# Altium project PWM_Controller_Half_Bridge_IR2110.PrjPCB
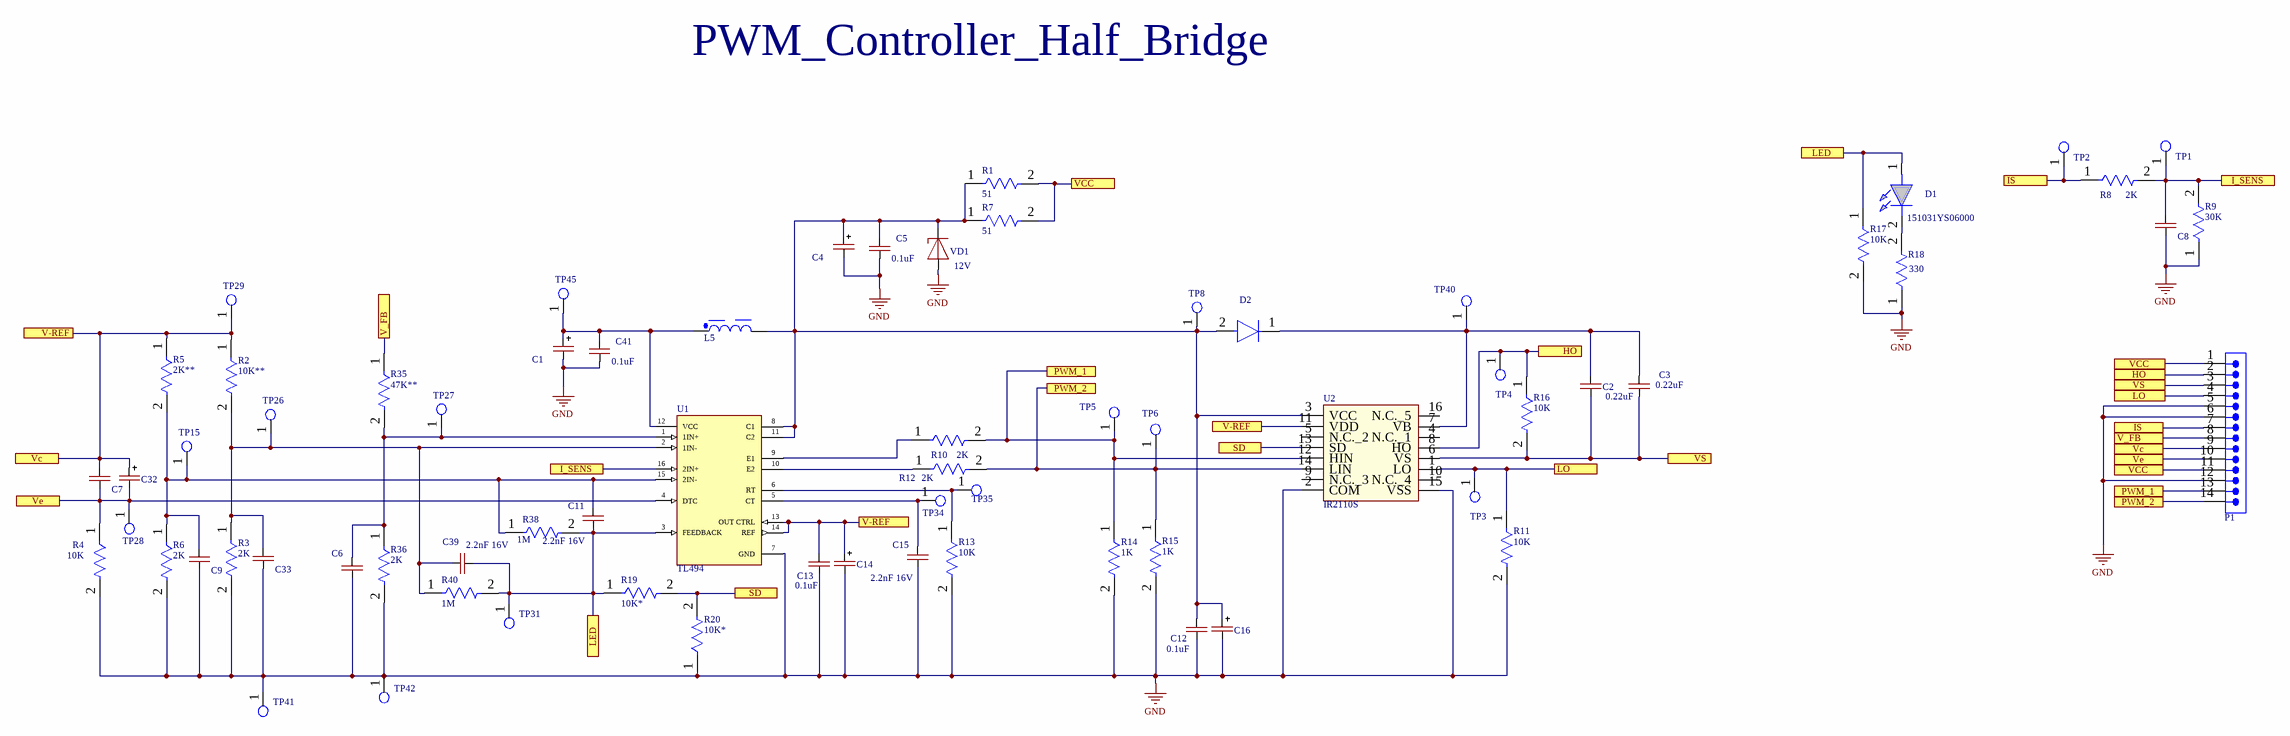
[diagram p0: PWM_Controller_Half_Bridge_IR2110.SchDoc]
1 sheet, 69 parts. Net scope: flat (ports and power ports of the same name join across sheets).
Board file: PWM_Controller_Half_Bridge_IR2110.PcbDoc

## Sheet PWM_Controller_Half_Bridge_IR2110.SchDoc
size A1; SPICEModelCacheYQEDCYZF: <root> / <DocumentId>YQEDCYZF</DocumentId> / <CacheFrame Number="0"> / <Model Name="7850_744775147_47u" Kind="CKT"> / <Text>******* / .subckt 7850_744775147_47u 1 2 / Rp 1 2 40000 / Cp 1 2 4p / Rs 1 N3 0.1343 / L1 N3 2 47u / .ends 7850_744775147_47u</Text> / </Model> / </CacheFrame> / </root>

### Parts
C1  CAP-POLAR  [SIZE_EEE]  (value not drawn)
C2  0.22uF  [FP-C1210X475K5RACTU-IPC_C]
C3  0.22uF  [FP-C1210X475K5RACTU-IPC_C]
C4  CAP-POLAR  [SIZE_EEE]  (value not drawn)
C5  0.1uF  [CAP-0805]
C6  CAP-NON-POLAR  [CAP-0805]  (value not drawn)
C7  CAP-NON-POLAR  [CAP-0805]  (value not drawn)
C8  CAP-NON-POLAR  [CAP-0805]  (value not drawn)
C9  CAP-NON-POLAR  [CAP-0805]  (value not drawn)
C11  2.2nF 16V  [CAP-0805]
C12  0.1uF  [CAP-0805]
C13  0.1uF  [CAP-0805]
C14  CAP-POLAR  [CAP-TAN-D]  (value not drawn)
C15  2.2nF 16V  [CAP-0805]
C16  CAP-POLAR  [CAP-TAN-D]  (value not drawn)
C32  CAP-POLAR  [CAP-TAN-D]  (value not drawn)
C33  CAP-NON-POLAR  [CAP-0805]  (value not drawn)
C39  2.2nF 16V  [CAP-0805]
C41  0.1uF  [CAP-0805]
D1  151031YS06000  [LED_RED]
D2  US1G  [DO-214AA]  (value not drawn)
L5  47µH, 1.17A  [WE-PD2_7850]  (value not drawn)
P1  61301411021  [61301411021]  (value not drawn)
R1  51  [FP-RMCF1210-MFG]
R2  10K**  [RES-0805]
R3  2K  [RES-0805]
R4  10K  [RES-0805]
R5  2K**  [RES-0805]
R6  2K  [RES-0805]
R7  51  [FP-RMCF1210-MFG]
R8  2K  [RES-0805]
R9  30K  [RES-0805]
R10  2K  [RES-0805]
R11  10K  [RES-0805]
R12  2K  [RES-0805]
R13  10K  [RES-0805]
R14  1K  [RES-0805]
R15  1K  [RES-0805]
R16  10K  [RES-0805]
R17  10K  [RES-0805]
R18  330  [RES-0805]
R19  10K*  [RES-0805]
R20  10K*  [RES-0805]
R35  47K**  [RES-0805]
R36  2K  [RES-0805]
R38  1M  [RES-0805]
R40  1M  [RES-0805]
TP1  (no value)  [Test_Point]
TP2  (no value)  [Test_Point]
TP3  (no value)  [Test_Point]
TP4  (no value)  [Test_Point]
TP5  (no value)  [Test_Point]
TP6  (no value)  [Test_Point]
TP8  (no value)  [Test_Point]
TP15  (no value)  [Test_Point]
TP26  (no value)  [Test_Point]
TP27  (no value)  [Test_Point]
TP28  (no value)  [Test_Point]
TP29  (no value)  [Test_Point]
TP31  (no value)  [Test_Point]
TP34  (no value)  [Test_Point]
TP35  (no value)  [Test_Point]
TP40  (no value)  [Test_Point]
TP41  (no value)  [Test_Point]
TP42  (no value)  [Test_Point]
TP45  (no value)  [Test_Point]
U1  TL494  [SOIC-16-M]
U2  IR2110S  [SOIC127P1036X391-16N]
VD1  12V  [DO-017AA]

### Ports
HO, I_SENS, IS, LED, LO, PWM_1, PWM_2, SD, V-REF, V_FB, Vc, VCC, Ve, VS

### Nets
GND: C1.2(-) C4.2(-) C5.1 C6.1 C8.1 C9.1 C12.1 C13.1 C14.2(-) C15.1 C16.2(-) C33.1 C41.1 P1.5 P1.6 P1.12 R3.2 R4.2 R6.2 R9.1 R11.2 R13.2 R14.2 R15.2 R17.2 R18.1 R20.1 R36.2 TP41.1(G9) TP42.1(G9) U1.7(GND) U2.2(COM) U2.15(VSS) VD1.2(A)
NetC1_1: C1.1(+) C41.2 L5.1 TP45.1(G9) U1.12(VCC)
NetC2_1: C2.1 C3.1 P1.3 R16.2 U2.6(VS) ; port VS
NetC2_2: C2.2 C3.2 D2.1(C) TP40.1(G9) U2.7(VB)
NetC4_1: C4.1(+) C5.2 C12.2 C16.1(+) D2.2(A) L5.2 R1.1 R7.1 TP8.1(G9) U1.8(C1) U1.11(C2) U2.3(VCC) VD1.1(C)
NetC6_2: C6.2 R35.2 R36.1 TP27.1(G9) U1.1(1IN+)
NetC7_1: C7.1 C32.2(-) P1.10 R4.1 TP28.1(G9) U1.4(DTC) ; port Ve
NetC7_2: C7.2 C13.2 C14.1(+) C32.1(+) P1.9 R2.1 R5.1 TP29.1(G9) U1.13(OUT_CTRL) U1.14(REF) U2.11(VDD) ; port V-REF, port Vc
NetC8_2: C8.2 R8.2 R9.2 TP1.1(G9) U1.16(2IN+) ; port I_SENS
NetC9_2: C9.2 C11.2 R5.2 R6.1 R38.1 TP15.1(G9) U1.15(2IN-)
NetC11_1: C11.1 C39.1 D1.1(A) R17.1 R19.1 R38.2 R40.2 TP31.1(G9) U1.3(FEEDBACK) ; port LED
NetC15_2: C15.2 TP34.1(G9) U1.5(CT)
NetC33_2: C33.2 C39.2 R2.2 R3.1 R40.1 TP26.1(G9) U1.2(1IN-)
NetD1_2: D1.2(K) R18.2
NetP1_1: P1.1 P1.11 R1.2 R7.2 ; port VCC
NetP1_2: P1.2 R16.1 TP4.1(G9) U2.8(HO) ; port HO
NetP1_4: P1.4 R11.1 TP3.1(G9) U2.1(LO) ; port LO
NetP1_7: P1.7 R8.1 TP2.1(G9) ; port IS
NetP1_8: P1.8 R35.1 ; port V_FB
NetP1_13: P1.13 R10.2 R14.1 TP5.1(G9) U2.12(HIN) ; port PWM_1
NetP1_14: P1.14 R12.2 R15.1 TP6.1(G9) U2.14(LIN) ; port PWM_2
NetR10_1: R10.1 U1.9(E1)
NetR12_1: R12.1 U1.10(E2)
NetR13_1: R13.1 TP35.1(G9) U1.6(RT)
NetR19_2: R19.2 R20.2 U2.13(SD) ; port SD

Not connected (* = marked no-connect by the designer): U2 4(N.C._1) 5(N.C._2) 9(N.C._3) 10(N.C._4) 16(N.C._5)

### Notes on the sheet
- PWM_Controller_Half_Bridge

### Library data of the parts
C2 C3 = CAP_1210
C5 C11-C13 C15 C39 C41 = CAP-NON-POLAR
D1 = LED: WURTH ELEKTRONIK - 151031YS06000 - LED, Yellow, Through Hole, T-1 (3mm), 30 mA, 2 V, 590 nm; Geometry.Height: 5.5mm; Manufacturer_Name: Wurth Elektronik; Manufacturer_Part_Number: 151031YS06000; Mouser Part Number: 710-151031YS06000; Mouser Price/Stock: https://www.mouser.co.uk/ProductDetail/Wurth-Elektronik/151031YS06000?qs=LlUlMxKIyB3xSYYW%252BcuBiQ%3D%3D; Arrow Part Number: *; Arrow Price/Stock: *; Mouser Testing Part Number: *; Mouser Testing Price/Stock: *; Datasheet Link: https://katalog.we-online.de/led/datasheet/151031YS06000.pdf
L5 = 744775147: WE-PD2 SMT Power Inductor, size 7850, 47µH, 1.17A, 0.18Ω; Manufacturer: Wurth Elektronik; Case/Size Code: 7850; DC Resistance: 0.134Ω; Saturation Current: 1.24A; Self Resonant Frequency: 12MHz; Manufacturer Part Number: 744775147; Category: Unshielded Power Inductors; Match Code: WE-PD2; ComponentLink1Description: Website Link; ComponentLink1URL: https://www.we-online.com/redexpert/article/744775147?ad; ComponentLink2Description: Datasheet Link; ComponentLink2URL: https://www.we-online.com/redexpert/spec/744775147?ad; Mount: Surface Mount; Operating Temperature Max: 125°C; Operating Temperature Min: -40°C; Packaging: Tape and Reel; Length: 7.8mm; Width: 7mm; Height: 4.95mm; DC Resistance Max: 0.18Ω; Inductance: 47µH; Rated Current: 1.17A
P1 = 61301411021: WR-PHD Pin Header, THT, Angled, pitch 2.54mm, 1 Row, 14P; Manufacturer: Wurth Elektronik; Contact Resistance: 20mΩ; Rated Current: 3A; Working Voltage: 250V; Withstanding Voltage: 500V; ComponentLink1Description: Website Link; ComponentLink1URL: https://www.we-online.com/redexpert/article/61301411021?ad; ComponentLink2Description: Datasheet Link; ComponentLink2URL: https://www.we-online.com/redexpert/spec/61301411021?ad; Manufacturer Part Number: 61301411021; Category: Board-to-Board Connectors; Match Code: WR-PHD; Mount: Through Hole; Operating Temperature Max: 105°C; Operating Temperature Min: -40°C; Packaging: Bag; Gender: Pin Header; Number of Pins: 14; Number of Rows: 1; Orientation: Angled; Pitch: 2.54mm
R1 R7 = CMP-26527-006785-1: 51Ω ±5% 0.5W 1210 Thick Film Chip Resistor AEC-Q200 compliant; Temperature Coefficient: 200ppm/°C; Resistance: 51R; Max Power Dissipation: 500mW; Case Code (Metric): 3225; Height: 0.028inch; Mount: Surface Mount; Max Operating Temperature: 155°C; Min Operating Temperature: -55°C; Length: 0.126inch; Features: Automotive AEC-Q200; Number of Terminations: 2; Width: 0.098inch; Case Code (Imperial): 1210; Packaging: Tape and Reel; Series: RMCF; Tolerance: 5%; Radiation Hardening: No; Contact Plating: Tin; RoHS Compliant: Yes; Case/Package: 1210; Lead Free: Lead Free; Resistor Type: Thick Film
R2 R19 R20 = RES-CONST: 10K
R3 R4 R6 R8-R18 R36 R38 R40 = RES-CONST
R5 = RES-CONST: 2K
R35 = RES-CONST: 47K
TP1-TP6 TP8 TP15 TP26-TP29 TP31 TP34 TP35 TP40-TP42 TP45 = TP_PCB?: Test_Point
U1 = TL494: TL494 Pwm controller
U2 = IR2110S: IC DRIVER HIGH/LOW SIDE 16-SOIC; Manufacturer_Name: Infineon; Geometry.Height: 2.65mm; Manufacturer_Part_Number: IR2110S; Mouser Part Number: *; Mouser Price/Stock: *; Arrow Part Number: *; Arrow Price/Stock: *; Datasheet Link: https://www.infineon.com/dgdl/ir2110.pdf?fileId=5546d462533600a4015355c80333167e
VD1 = ZENER